# EAGLE design main (EAGLE 6.3)
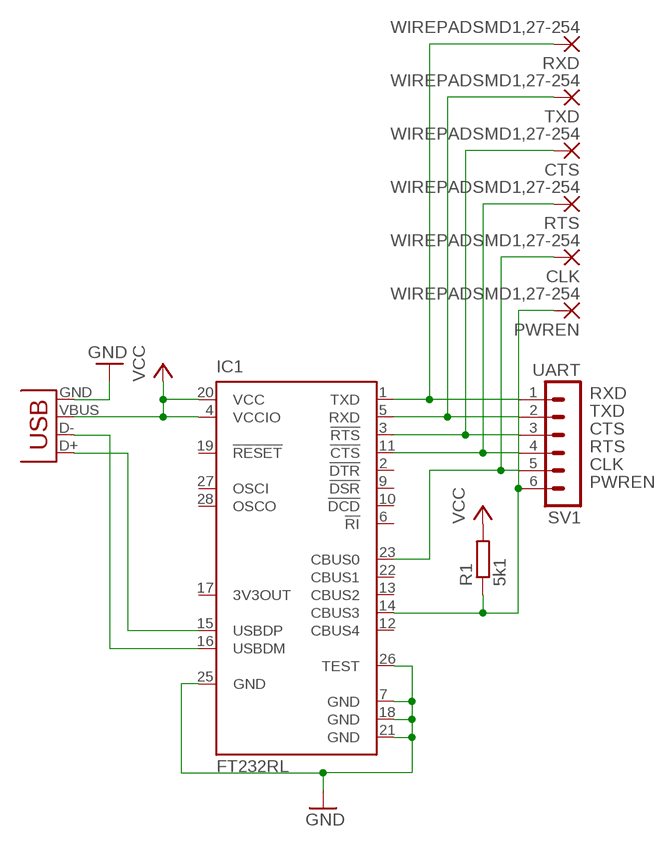
[diagram p0: schematic, sheet 1]

## Parts
CLK  WIREPADSMD1,27-254  [SMD1,27-2,54]
CTS  WIREPADSMD1,27-254  [SMD1,27-2,54]
IC1  FT232RL  [SSOP28]
PWREN  WIREPADSMD1,27-254  [SMD1,27-2,54]
R1  5k1  R-EU_R0805  [R0805]
RTS  WIREPADSMD1,27-254  [SMD1,27-2,54]
RXD  WIREPADSMD1,27-254  [SMD1,27-2,54]
SV1  UART  MA06-1  [MA06-1]
TXD  WIREPADSMD1,27-254  [SMD1,27-2,54]
X1  USB-MICROB  [USB-MICROB]

## Nets
CLK: CLK.1(P) IC1.23(CBUS0) SV1.5
CTS: CTS.1(P) IC1.3(!RTS) SV1.3
GND: IC1.7(GND) IC1.18(GND) IC1.21(GND) IC1.25(GND) IC1.26(TEST) X1.GND
N$9: IC1.15(USBDP) X1.D+
N$10: IC1.16(USBDM) X1.D-
PWREN: IC1.14(CBUS3) PWREN.1(P) R1.1 SV1.6
RTS: IC1.11(!CTS) RTS.1(P) SV1.4
RXD: IC1.1(TXD) RXD.1(P) SV1.1
TXD: IC1.5(RXD) SV1.2 TXD.1(P)
VCC: IC1.4(VCCIO) IC1.20(VCC) R1.2 X1.VBUS
Unconnected: IC1.2(!DTR) IC1.6(!RI) IC1.9(!DSR) IC1.10(!DCD) IC1.12(CBUS4) IC1.13(CBUS2) IC1.17(3V3OUT) IC1.19(!RESET) IC1.22(CBUS1) IC1.27(OSCI) IC1.28(OSCO)

## Library data of the parts
CLK CTS PWREN RTS RXD TXD = wirepad:WIREPAD: Wire PAD connect wire on PCB
IC1 = ftdichip:FT232R: Source: http://www.ftdichip.com/Documents/DataSheets/DS_FT232R_v104.pdf; MPN: FT232RL; OC_FARNELL: 1146032; OC_NEWARK: 91K9918
R1 = resistor:R-EU_: RESISTOR, European symbol
SV1 = con-lstb:MA06-1: PIN HEADER; OC_FARNELL: unknown; OC_NEWARK: unknown
X1 = SparkFun:USB: USB Connectors USB-B-PTH is fully proven SKU : PRT-00139 USB-miniB is fully proven SKU : PRT-00587 USB-A-PCB is untested. USB-A-H is throughly reviewed, but untested. Spark Fun Electronics SKU : PRT-00437 USB-B-SMT is throughly reviewed, but untested. Needs silkscreen touching up. USB-A-S has not been used/tested USB-MB-H has not been used/tested

## Board
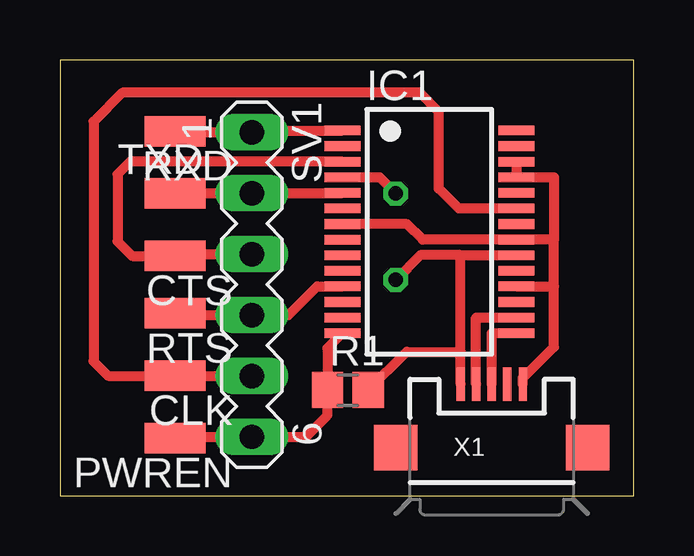
[diagram p1: board, top side]
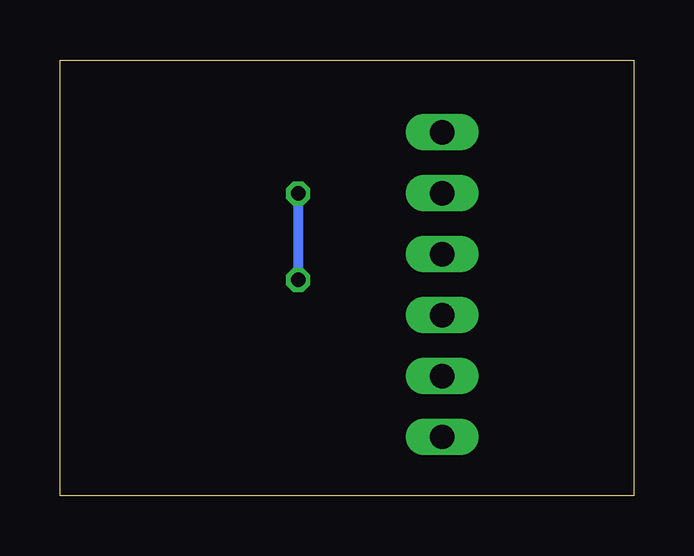
[diagram p2: board, bottom side, seen from below]

Size 23.93 x 18.17 mm. Coordinates in mm from the lower left corner, seen from the top.
Outline: 0,0 23.93,0 23.93,18.17 0,18.17 0,0
Copper layers (1*16): Top 0.035mm / dielectric 1.5mm / Bottom 0.035mm
Design rules "default": minimum track width 10mil, minimum drill 24mil, track to track 8mil, track to pad 8mil, pad to pad 8mil, via to via 8mil, smd to smd 8mil, copper to edge 40mil, drill to drill 8mil, minimum pad ring 10mil, minimum via ring 8mil, stop-mask expansion 4mil, vias tented up to drill 0mil, thermal gap 10mil

### Footprints (pad centres in the part's own frame; a part is rotated, then mirrored left to right if it is on the bottom)
SMD1,27-2,54 = smd 1.27 x 2.54: 1 0,0
SSOP28 = smd 0.4 x 1.5: 1 -4.225,-3.625; 2 -3.575,-3.625; 3 -2.925,-3.625; 4 -2.275,-3.625; 5 -1.625,-3.625; 6 -0.975,-3.625; 7 -0.325,-3.625; 8 0.325,-3.625; 9 0.975,-3.625; 10 1.625,-3.625; 11 2.275,-3.625; 12 2.925,-3.625; 13 3.575,-3.625; 14 4.225,-3.625; 15 4.225,3.625; 16 3.575,3.625; 17 2.925,3.625; 18 2.275,3.625; 19 1.625,3.625; 20 0.975,3.625; 21 0.325,3.625; 22 -0.325,3.625; 23 -0.975,3.625; 24 -1.625,3.625; 25 -2.275,3.625; 26 -2.925,3.625; 27 -3.575,3.625; 28 -4.225,3.625
R0805 = smd 1.3 x 1.5: 1 -0.85,0; 2 0.85,0
MA06-1 = drill 1.016 long: 1 -6.35,0; 2 -3.81,0; 3 -1.27,0; 4 1.27,0; 5 3.81,0; 6 6.35,0
USB-MICROB = smd 0.35 x 1.4: D+ 0,2.65; D- -0.65,2.65; GND 1.3,2.65; ID 0.65,2.65; VBUS -1.3,2.65 | smd 1.8 x 1.9: MT1 -4,0; MT2 4,0

### Placement (x,y rotation side)
CLK  4.8,5 90 top
CTS  4.8,10 90 top
IC1  15.4,11 270 top
PWREN  4.8,2.4 90 top
R1  12,4.4 0 top
RTS  4.8,7.6 90 top
RXD  4.8,15.2 90 top
SV1  8,8.8 270 top
TXD  4.8,12.6 270 top
X1  18,2 0 top

### Tracks (layer width: path | path; a pad name or v marks a point on that pad's centre or on a via)
CLK
  Top 0.406: SV1.5 CLK.1 2,5 1.4,5.6 1.4,15.6 2.6,16.8 15,16.8 15.8,16 15.8,12.8 16.62,11.97 IC1.23
CTS
  Top 0.406: SV1.3 4.87,10.07 CTS.1 3,10 2.4,10.6 2.4,13.4 2.93,13.92 IC1.3
GND
  Top 0.406: IC1.26 IC1.25 20.6,13.27 20.6,10.67 | X1.GND 19.3,4.9 20.6,6.2 20.6,8.72 | IC1.18 20.6,8.72 | 20.6,8.72 20.6,10.67 | 20.6,10.67 IC1.21 15.12,10.67 14.47,11.32 IC1.7
N$9
  Top 0.406: X1.D+ 18,6.78 IC1.15
N$10
  Top 0.406: X1.D- 17.35,7.42 IC1.16
PWREN
  Top 0.406: IC1.14 11.15,6.15 R1.1 11.15,3.35 10.25,2.45 SV1.6 4.85,2.45 PWREN.1
RTS
  Top 0.406: RTS.1 4.87,7.53 SV1.4 9.53,7.53 10.72,8.72 IC1.11
RXD
  Top 0.406: IC1.1 8.07,15.22 SV1.1 4.85,15.15 RXD.1
TXD
  Top 0.406: IC1.5 8.02,12.62 SV1.2 TXD.1
VCC  (via drill 0.6)
  Top 0.406: X1.VBUS 16.7,6 | 16.7,6 16.7,10.02 | 16.7,10.02 IC1.20 | IC1.4 13.32,13.27 v14,12.6 | 16.7,10.02 15.03,10.02 v14,9 | R1.2 14.45,6 16.7,6
  Bottom 0.406: v14,12.6 v14,9